# EasyEDA schematic acceleration_particul_ariel.json
TITLE: arduino ProMicro; REV: 1.0; Date: 2025-04-22; Sheet: 1/1; Drawn By: nath8505; Company: Your Company
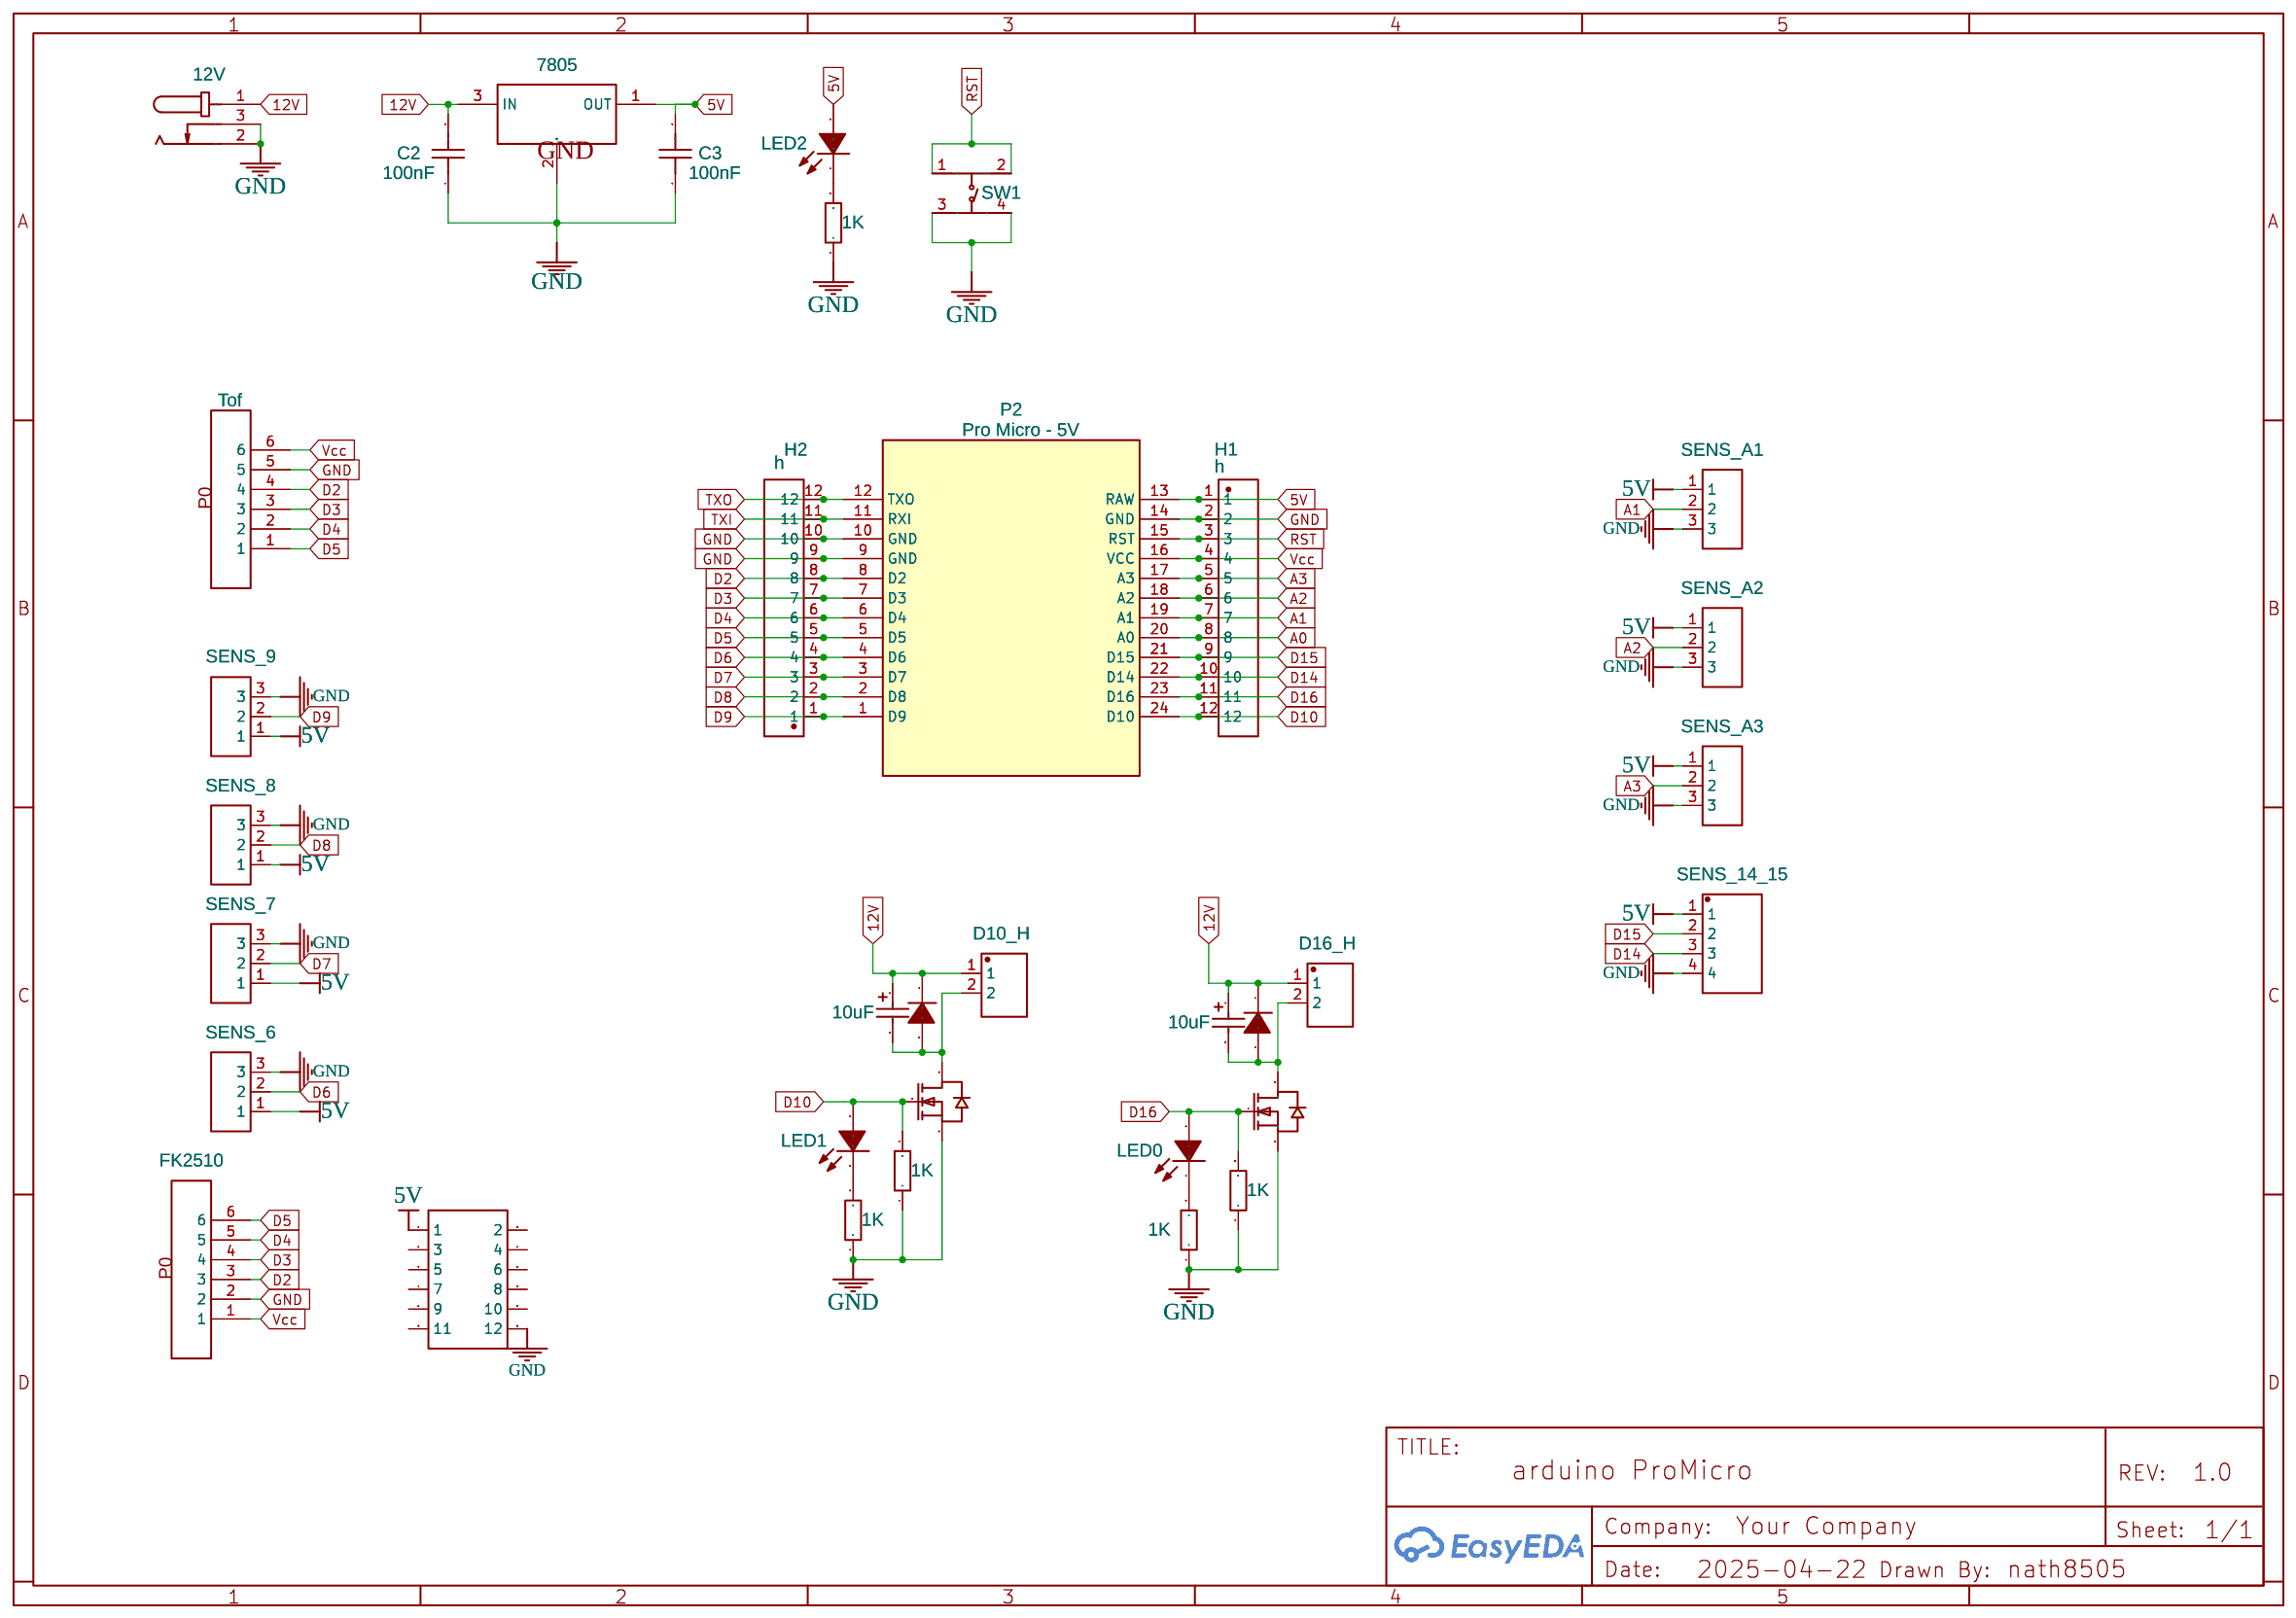
[diagram p0: schematic sheet]

## Parts
12V  12V  [DC-IN-TH_DC005]
7805  SE78L05  [SOT-89-3_L4.5-W2.5-P1.50-LS4.2-BR]
C0  10uF  [CAP-SMD_L3.2-W1.6-RD-C7171]
C1  10uF  [CAP-SMD_L3.2-W1.6-RD-C7171]
C2  100nF  [C0603]
C3  100nF  [C0603]
D0  1N4007  [SMAF_L3.5-W2.6-LS4.7-RD]
D1  1N4007  [SMAF_L3.5-W2.6-LS4.7-RD]
D10_H  KF2510-2A  [CONN-TH_KF2510-2A]
D16_H  KF2510-2A  [CONN-TH_KF2510-2A]
H1  h  [HDR-TH_12P-P2.54-V-M]
H2  h  [HDR-TH_12P-P2.54-V-M]
H4  Header-Female-2.54_2x6  [HDR-TH_12P-P2.54-V-F-R2-C6-S2.54]
I2C_TOF1  Tof  [PINHEADER6]
I2C_TOF2  FK2510  [PINHEADER6]
LED0  KT-0603R  [LED0603-RD]
LED1  KT-0603R  [LED0603-RD]
LED2  KT-0603R  [LED0603-RD]
P2  Pro Micro - 5V  [PRO MICRO - 5V]
R0  1K  [R0603]
R1  1K  [R0603]
R2  1K  [R0603]
R3  1K  [R0603]
R4  1K  [R0603]
SENS_6  FK2510  [CONN-TH_3P-P2.00_KF2510_3A]
SENS_7  FK2510  [CONN-TH_3P-P2.00_KF2510_3A]
SENS_8  FK2510  [CONN-TH_3P-P2.00_KF2510_3A]
SENS_9  FK2510  [CONN-TH_3P-P2.00_KF2510_3A]
SENS_14_15  SENS_14_15  [CON-TH_4PIN_KF2510-3A]
SENS_A1  FK2510  [CONN-TH_3P-P2.00_KF2510_3A]
SENS_A2  FK2510  [CONN-TH_3P-P2.00_KF2510_3A]
SENS_A3  FK2510  [CONN-TH_3P-P2.00_KF2510_3A]
SW1  TC-6610-7-160G  [SW-TH_4P-L5.0-W5.0-P4.50-LS6.5]
T1  Q  [SOT-23-3_L2.9-W1.3-P0.95-LS2.4-BR]
T2  Q  [SOT-23-3_L2.9-W1.3-P0.95-LS2.4-BR]

## Library data of the parts
12V = DC005-2.0MM: Supplier: LCSC; Manufacturer: SOFNG; Supplier Part: C111567; Package Display: No
7805 = SE78L05: Supplier: LCSC; Manufacturer: SEAWARD(思旺); Supplier Part: C114992; JLCPCB Part Class: Extended Part
C0 C1 = TAJA106K016RNJ: JLCPCB Part Class: Basic Part; Package Display: No
C2 C3 = CC0603KRX7R9BB104: JLCPCB Part Class: Basic Part; Package Display: No
D0 D1 = 1N4007F: Supplier: LCSC; Manufacturer: SK; Supplier Part: C110856; JLCPCB Part Class: Extended Part; Package Display: No
D10_H D16_H = KF2510-2A: Supplier: LCSC; Manufacturer: BOOMELE; Supplier Part: C27543; JLCPCB Part Class: Extended Part; Package Display: No
H1 H2 = DS1021-1X12SF11-B: Supplier: LCSC; Supplier Part: C7430368; Manufacturer: CONNFLY; Manufacturer Part: DS1021-1x12SF11-B; JLCPCB Part Class: Extended Part; Contributor: lcsc
H4 = Header-Female-2.54_2x6: Supplier: LCSC; Manufacturer: BOOMELE(博穆精密); Manufacturer Part: 2.54-2*6P母; Supplier Part: C36191; JLCPCB Part Class: Extended Part
I2C_TOF1 I2C_TOF2 = PinHeader6: Contributor: AmrW.
LED0-LED2 = KT-0603R: Supplier: LCSC; Manufacturer: KENTO; Supplier Part: C2286; JLCPCB Part Class: Basic Part; Package Display: No
P2 = Pro Micro - 5V: sourceId: 1T5FDZYC8
R0-R4 = 0603WAF1001T5E: Supplier: LCSC; Manufacturer: UniOhm; Supplier Part: C21190; JLCPCB Part Class: Basic Part; Package Display: No
SENS_6-SENS_9 SENS_A1-SENS_A3 = kf2510_3A: JLCPCB Part Class: Extended Part; Package Display: No
SENS_14_15 = Conector KF2510_3A.ventilador.4pin: Supplier: LCSC; Manufacturer: Ckmtw; Manufacturer Part: 210S-1*4P L=11.6MMGold-plated black; Contributor: amocachi; Supplier Part: C124378
SW1 = TC-6610-7-160G: Contributor: LCSC; Supplier: LCSC; Supplier Part: C2845252; Manufacturer: HCTL(华灿天禄); JLCPCB Part Class: Extended Part; Package Display: No
T1 T2 = JSM2302: Supplier: LCSC; Supplier Part: C5224189; Manufacturer: ElecSuper(静芯微）; Manufacturer Part: AO3400; Contributor: LCSC; JLCPCB Part Class: Extended Part; Package Display: No

## Nets
5V: 7805.1(OUT) C3.2 H1.1 H4.1 LED2.2(A) P2.13(RAW) SENS_6.1 SENS_7.1 SENS_8.1 SENS_9.1 SENS_14_15.1 SENS_A1.1 SENS_A2.1 SENS_A3.1
12V: 12V.1 7805.3(IN) C0.1 C1.1 C2.2 D0.1(C) D1.1(C) D10_H.1 D16_H.1
GND: 12V.2 12V.3 7805.2(GND) C2.1 C3.1 H1.2 H2.9 H2.10 H4.12 I2C_TOF1.5 I2C_TOF2.2 P2.9(GND) P2.10(GND) P2.14(GND) R0.1 R1.1 R2.1 R3.1 R4.1 SENS_6.3 SENS_7.3 SENS_8.3 SENS_9.3 SENS_14_15.4 SENS_A1.3 SENS_A2.3 SENS_A3.3 SW1.3 SW1.4 T1.2(S) T2.2(S)
Vcc: H1.4 I2C_TOF1.6 I2C_TOF2.1 P2.16(VCC)
A0: H1.8 P2.20(A0)
A1: H1.7 P2.19(A1) SENS_A1.2
A2: H1.6 P2.18(A2) SENS_A2.2
A3: H1.5 P2.17(A3) SENS_A3.2
D2: H2.8 I2C_TOF1.4 I2C_TOF2.3 P2.8(D2)
D3: H2.7 I2C_TOF1.3 I2C_TOF2.4 P2.7(D3)
D4: H2.6 I2C_TOF1.2 I2C_TOF2.5 P2.6(D4)
D5: H2.5 I2C_TOF1.1 I2C_TOF2.6 P2.5(D5)
D6: H2.4 P2.4(D6) SENS_6.2
D7: H2.3 P2.3(D7) SENS_7.2
D8: H2.2 P2.2(D8) SENS_8.2
D9: H2.1 P2.1(D9) SENS_9.2
D10: H1.12 LED1.2(A) P2.24(D10) R2.2 T1.1(G)
D14: H1.10 P2.22(D14) SENS_14_15.3
D15: H1.9 P2.21(D15) SENS_14_15.2
D16: H1.11 LED0.2(A) P2.23(D16) R1.2 T2.1(G)
RST: H1.3 P2.15(RST) SW1.1 SW1.2
TXI: H2.11 P2.11(RXI)
TXO: H2.12 P2.12(TXO)
Net-(C0-2): C0.2 D0.2(A) D10_H.2 T1.3(D)
Net-(C1-2): C1.2 D1.2(A) D16_H.2 T2.3(D)
Net-(LED0-1): LED0.1(K) R0.2
Net-(LED1-1): LED1.1(K) R3.2
Net-(LED2-1): LED2.1(K) R4.2

Not connected (* = marked no-connect by the designer): H4 2 3 4 5 6 7 8 9 10 11
